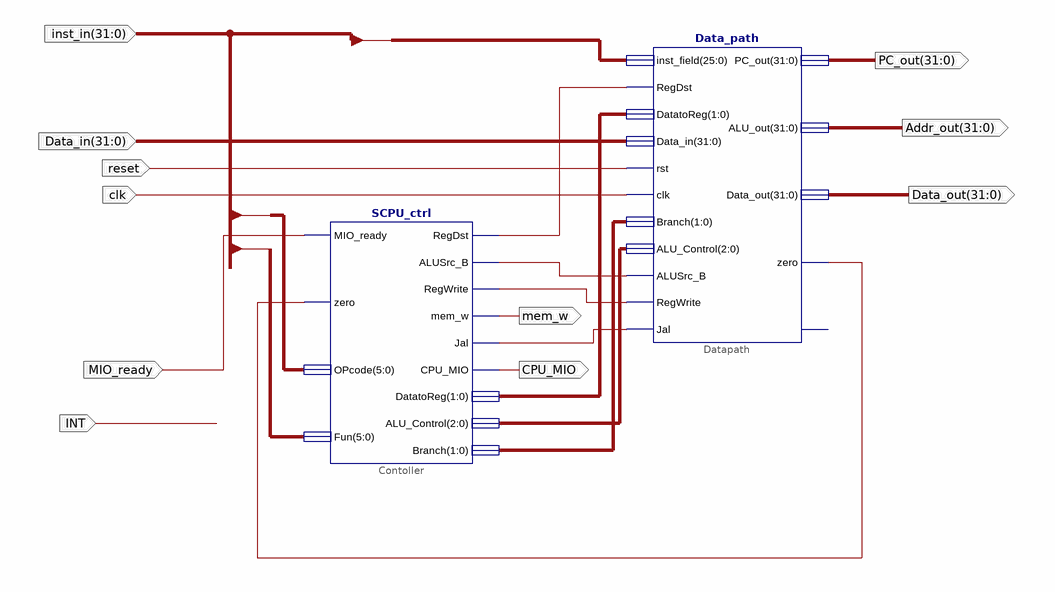
[diagram p0: schematic sheet 1]
// Xilinx ISE schematic SCPU_More.sch (kintex7) as structural Verilog: 2 symbols, 11 ports
module SCPU_More (
  input  clk,
  input  reset,
  input  [31:0] Data_in,
  input  [31:0] inst_in,
  input  INT,
  input  MIO_ready,
  output mem_w,
  output CPU_MIO,
  output [31:0] Addr_out,
  output [31:0] Data_out,
  output [31:0] PC_out
);

  wire XLXN_17, XLXN_18, XLXN_19, XLXN_20, zero;
  wire [1:0] XLXN_21, XLXN_23;
  wire [2:0] XLXN_22;

  Data_path Datapath (
    .inst_field(inst_in[25:0]), .RegDst(XLXN_20), .DatatoReg(XLXN_21), .Data_in(Data_in), .rst(reset),
    .clk(clk), .Branch(XLXN_23), .ALU_Control(XLXN_22), .ALUSrc_B(XLXN_19), .RegWrite(XLXN_18),
    .Jal(XLXN_17), .PC_out(PC_out), .ALU_out(Addr_out), .Data_out(Data_out), .zero(zero));  // open: overflow
  SCPU_ctrl Contoller (
    .MIO_ready(MIO_ready), .zero(zero), .OPcode(inst_in[31:26]), .Fun(inst_in[5:0]), .RegDst(XLXN_20),
    .ALUSrc_B(XLXN_19), .RegWrite(XLXN_18), .mem_w(mem_w), .Jal(XLXN_17), .CPU_MIO(CPU_MIO),
    .DatatoReg(XLXN_21), .ALU_Control(XLXN_22), .Branch(XLXN_23));
endmodule
